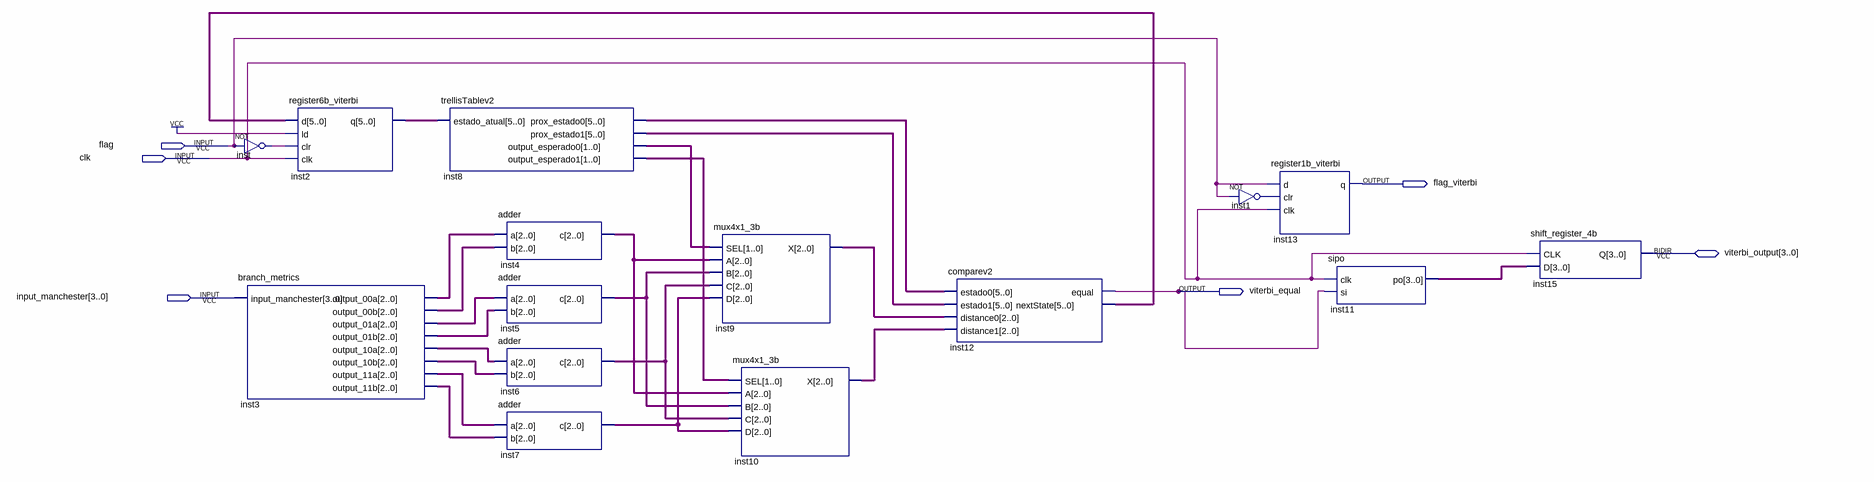
[diagram p0: schematic sheet]
// Quartus schematic viterbiv2.bdf as structural Verilog: 15 symbols, 6 pins
module viterbiv2 (
  input  flag,
  input  clk,
  input  [3:0] input_manchester,
  inout  [3:0] viterbi_output,
  output flag_viterbi,
  output viterbi_equal
);

  wire inst1_out, inst_out;
  wire [1:0] inst8_output_esperado0, inst8_output_esperado1;
  wire [2:0] inst3_output_00a, inst3_output_00b, inst3_output_01a, inst3_output_01b, inst3_output_10a,
       inst3_output_10b, inst3_output_11a, inst3_output_11b, inst4_c, inst5_c, inst6_c, inst7_c, inst9_x,
       inst10_x;
  wire [3:0] inst11_po;
  wire [5:0] inst2_q, inst8_prox_estado0, inst8_prox_estado1, inst12_nextstate;

  not inst (inst_out, flag);
  branch_metrics inst3 (
    .input_manchester(input_manchester), .output_00a(inst3_output_00a), .output_00b(inst3_output_00b),
    .output_01a(inst3_output_01a), .output_01b(inst3_output_01b), .output_10a(inst3_output_10a),
    .output_10b(inst3_output_10b), .output_11a(inst3_output_11a), .output_11b(inst3_output_11b));
  register6b_viterbi inst2 (.d(inst12_nextstate), .ld(1'b1), .clr(inst_out), .clk(clk), .q(inst2_q));
  trellisTablev2 inst8 (
    .estado_atual(inst2_q), .prox_estado0(inst8_prox_estado0), .prox_estado1(inst8_prox_estado1),
    .output_esperado0(inst8_output_esperado0), .output_esperado1(inst8_output_esperado1));
  adder inst4 (.a(inst3_output_00a), .b(inst3_output_00b), .c(inst4_c));
  adder inst5 (.a(inst3_output_01a), .b(inst3_output_01b), .c(inst5_c));
  adder inst6 (.a(inst3_output_10a), .b(inst3_output_10b), .c(inst6_c));
  adder inst7 (.a(inst3_output_11a), .b(inst3_output_11b), .c(inst7_c));
  mux4x1_3b inst9 (.SEL(inst8_output_esperado0), .A(inst4_c), .B(inst5_c), .C(inst6_c), .D(inst7_c), .X(inst9_x));
  mux4x1_3b inst10 (.SEL(inst8_output_esperado1), .A(inst4_c), .B(inst5_c), .C(inst6_c), .D(inst7_c), .X(inst10_x));
  comparev2 inst12 (
    .estado0(inst8_prox_estado0), .estado1(inst8_prox_estado1), .distance0(inst9_x), .distance1(inst10_x),
    .equal(viterbi_equal), .nextState(inst12_nextstate));
  not inst1 (inst1_out, flag);
  register1b_viterbi inst13 (.d(flag), .clr(inst1_out), .clk(clk), .q(flag_viterbi));
  sipo inst11 (.clk(clk), .si(viterbi_equal), .po(inst11_po));
  shift_register_4b inst15 (.CLK(clk), .D(inst11_po), .Q(viterbi_output));
endmodule
